# EAGLE design Arduino with Ribbon 7 segment display (EAGLE 7.2.0)
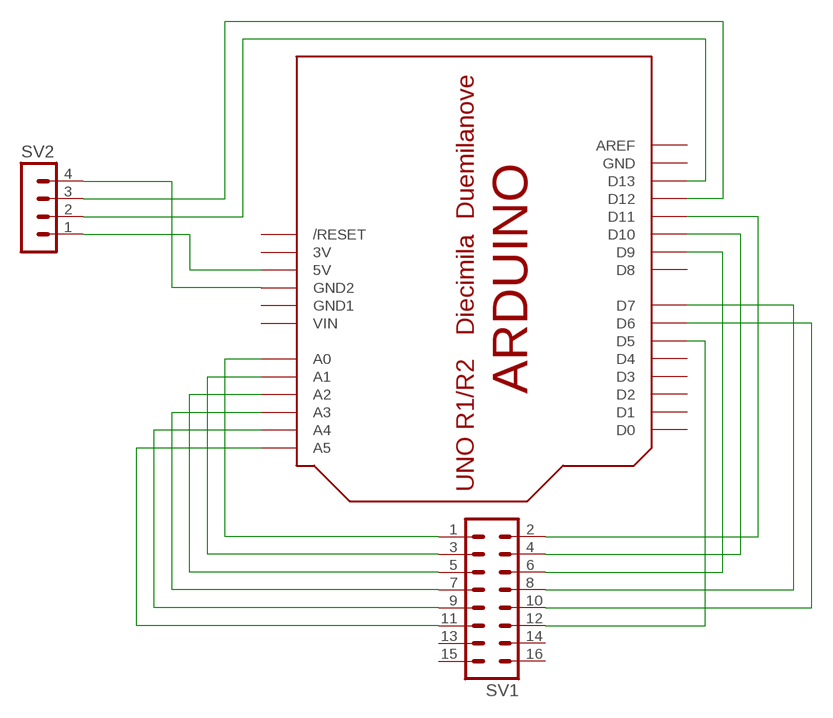
[diagram p0: schematic, sheet 1]

## Parts
SV1  MA08-2  [MA08-2]
SV2  MA04-1  [MA04-1]
U$1  ARDUINO-BPLACE  [ARDUINO-BPLACE]

## Nets
N$1: SV1.2 U$1.D11
N$2: SV1.4 U$1.D10
N$3: SV1.6 U$1.D9
N$4: SV1.8 U$1.D7
N$5: SV1.10 U$1.D6
N$6: SV1.12 U$1.D5
N$7: SV1.1 U$1.A0
N$8: SV1.3 U$1.A1
N$9: SV1.5 U$1.A2
N$10: SV1.7 U$1.A3
N$11: SV1.9 U$1.A4
N$12: SV1.11 U$1.A5
N$13: SV2.4 U$1.GND2
N$14: SV2.1 U$1.5V
N$15: SV2.3 U$1.D12
N$16: SV2.2 U$1.D13
Unconnected: SV1.13 SV1.14 SV1.15 SV1.16 U$1.AREF U$1.D0 U$1.D1 U$1.D2 U$1.D3 U$1.D4 U$1.D8 U$1.RESET(/RESET)

## Power pins joined to a net without a drawn wire
3V: U$1.3V
GND: U$1.GND
GND1: U$1.GND1
VIN: U$1.VIN

## Library data of the parts
SV1 = con-lstb:MA08-2: PIN HEADER; OC_FARNELL: unknown; OC_NEWARK: unknown
SV2 = con-lstb:MA04-1: PIN HEADER; OC_FARNELL: unknown; OC_NEWARK: unknown
U$1 = adafruit:ARDUINO: Arduino Diecimila/Duemilanove Make a shield with ease, this package has all the named pins as well as the two mounting drill holes and an outline of the USB and DC power connector. The outline is on the DIMENSION layer, so if your board house uses it they will cut the outline to match. http://www.ladyada.net/library/pcb/eaglelibrary.html

## Board
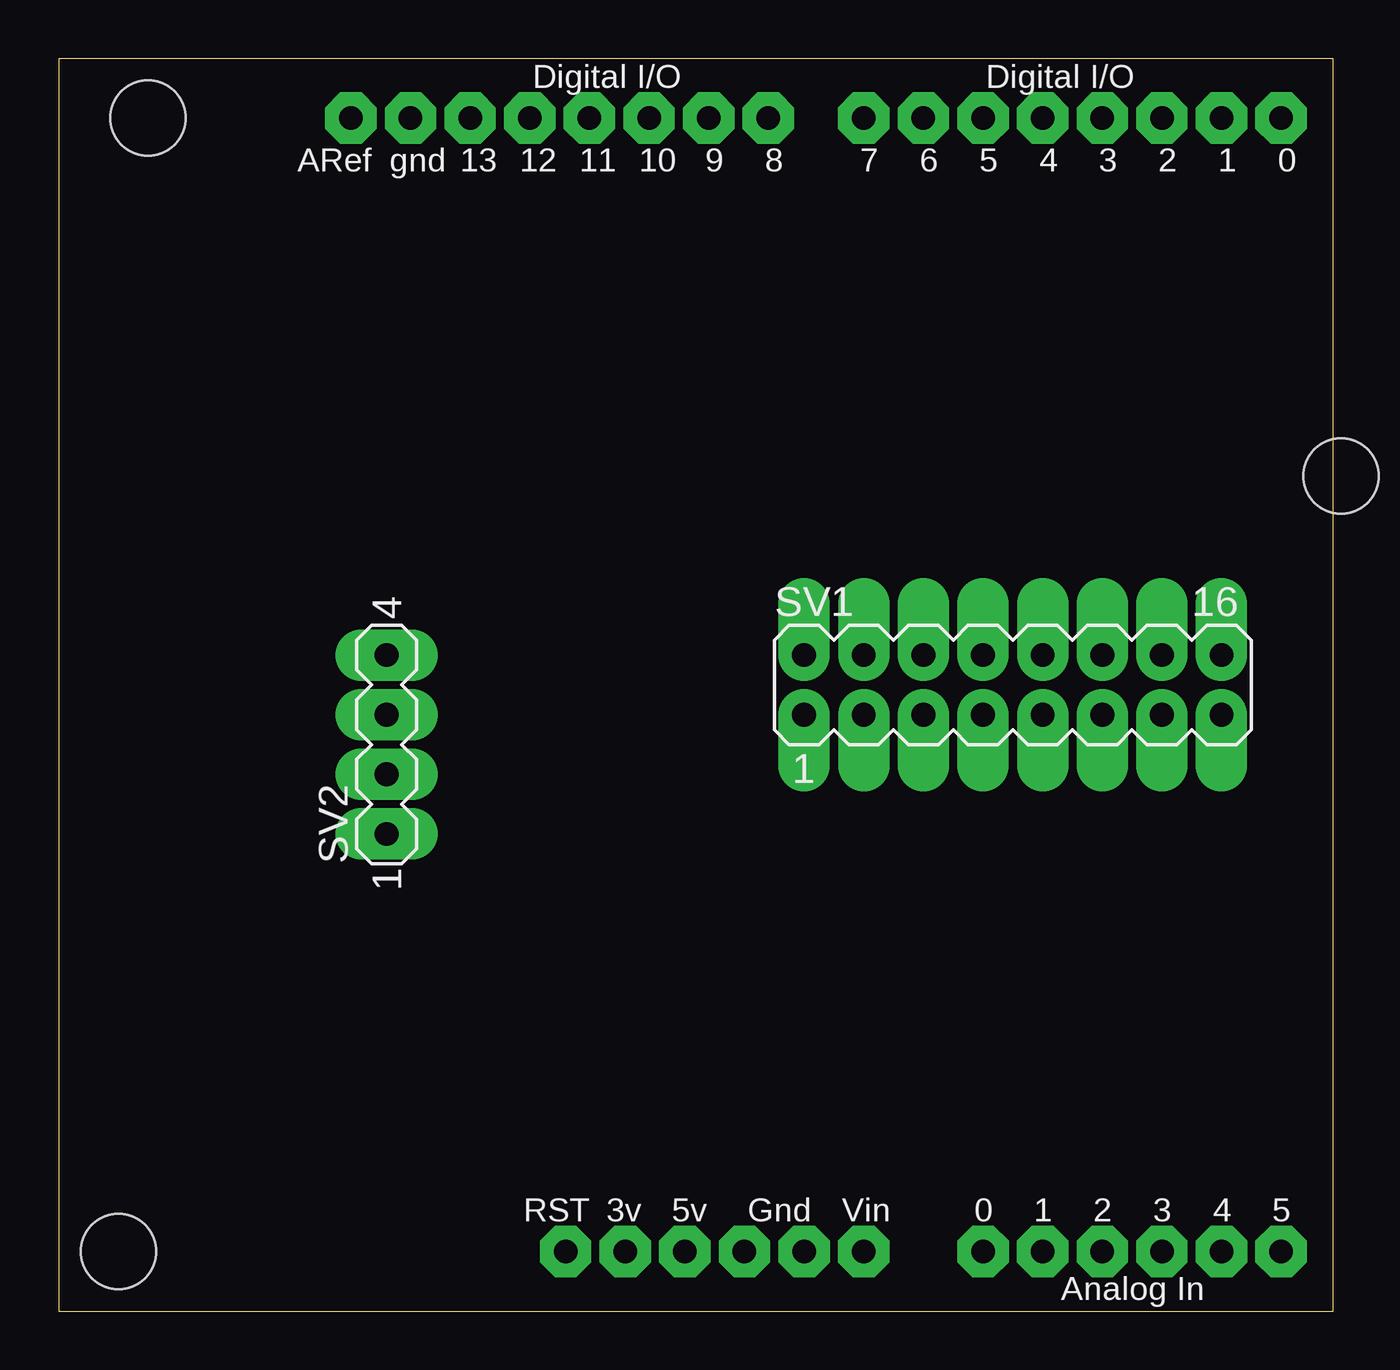
[diagram p1: board, top side]
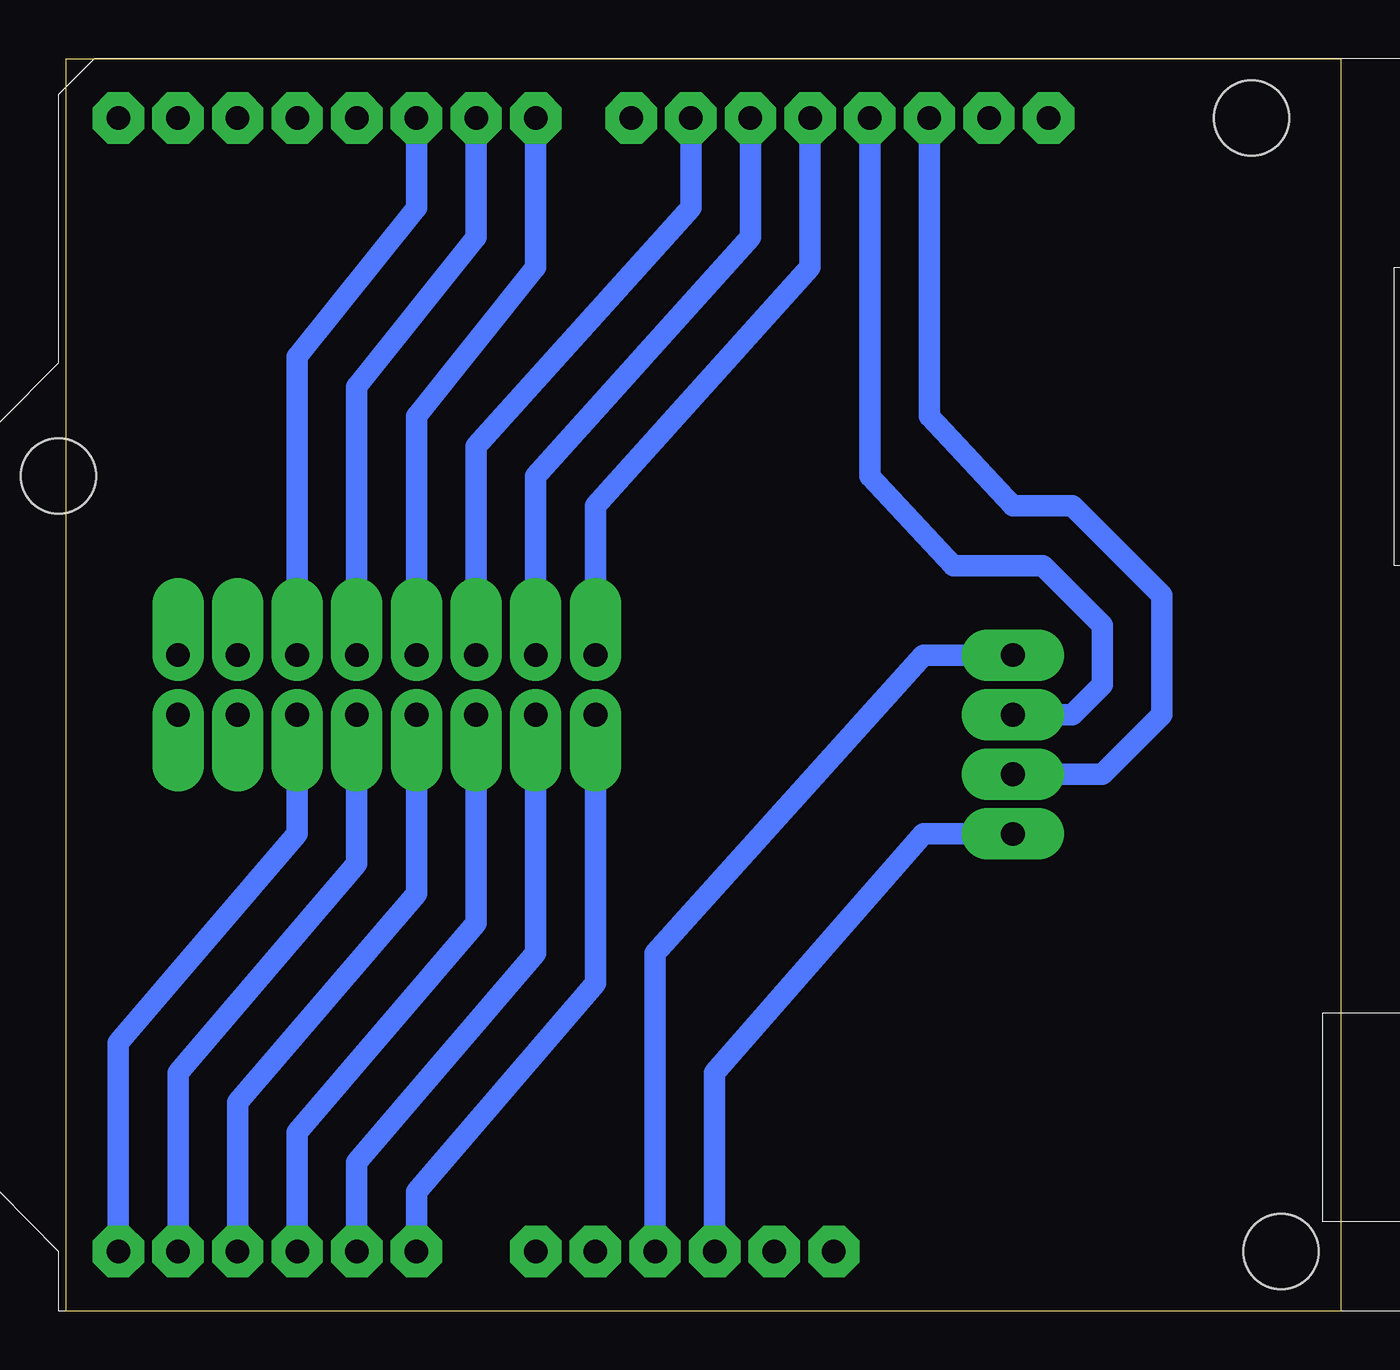
[diagram p2: board, bottom side, seen from below]

Size 54.28 x 53.33 mm. Coordinates in mm from the lower left corner, seen from the top.
Outline: 0,0 54.28,0 54.28,53.33 0,53.33 0,0
Copper layers (1*16): Top 0.035mm / dielectric 1.5mm / Bottom 0.035mm
Design rules "default": minimum track width 40mil, minimum drill 24mil, track to track 40mil, track to pad 40mil, pad to pad 40mil, via to via 40mil, smd to smd 8mil, copper to edge 40mil, drill to drill 8mil, minimum pad ring 10mil, minimum via ring 8mil, stop-mask expansion 4mil, vias tented up to drill 0mil, thermal gap 10mil

### Footprints (pad centres in the part's own frame; a part is rotated, then mirrored left to right if it is on the bottom)
MA08-2 = drill 1.016 pad 2.184 offset: 1 -8.89,-1.27; 2 -8.89,1.27; 3 -6.35,-1.27; 4 -6.35,1.27; 5 -3.81,-1.27; 6 -3.81,1.27; 7 -1.27,-1.27; 8 -1.27,1.27; 9 1.27,-1.27; 10 1.27,1.27; 11 3.81,-1.27; 12 3.81,1.27; 13 6.35,-1.27; 14 6.35,1.27; 15 8.89,-1.27; 16 8.89,1.27
MA04-1 = drill 1.016 pad 2.184 long: 1 -3.81,0; 2 -1.27,0; 3 1.27,0; 4 3.81,0
ARDUINO-BPLACE = drill 1 pad 2.184 octagon: 3V 35.56,2.54; 5V 38.1,2.54; A0 50.8,2.54; A1 53.34,2.54; A2 55.88,2.54; A3 58.42,2.54; A4 60.96,2.54; A5 63.5,2.54; AREF 23.876,50.8; D0 63.5,50.8; D1 60.96,50.8; D2 58.42,50.8; D3 55.88,50.8; D4 53.34,50.8; D5 50.8,50.8; D6 48.26,50.8; D7 45.72,50.8; D8 41.656,50.8; D9 39.116,50.8; D10 36.576,50.8; D11 34.036,50.8; D12 31.496,50.8; D13 28.956,50.8; GND 26.416,50.8; GND1 43.18,2.54; GND2 40.64,2.54; RESET 33.02,2.54; VIN 45.72,2.54 | hole 3.2: 15.24,50.8; 66.04,35.56; 13.97,2.54

### Placement (x,y rotation side)
SV1  40.64,26.67 0 top
SV2  13.97,24.13 90 top
U$1  -11.43,0 0 top

### Tracks (layer width: path | path; a pad name or v marks a point on that pad's centre or on a via)
N$1
  Bottom 0.914: SV1.2 31.75,34.29 22.61,44.45 U$1.D11
N$2
  Bottom 0.914: SV1.4 34.29,35.56 25.15,45.72 U$1.D10
N$3
  Bottom 0.914: SV1.6 36.83,36.83 27.69,46.99 U$1.D9
N$4
  Bottom 0.914: SV1.8 39.37,38.1 34.29,44.45 U$1.D7
N$5
  Bottom 0.914: SV1.10 41.91,39.37 36.83,45.72 U$1.D6
N$6
  Bottom 0.914: SV1.12 44.45,40.64 39.37,46.99 U$1.D5
N$7
  Bottom 0.914: U$1.A0 39.37,5.08 31.75,13.97 SV1.1
N$8
  Bottom 0.914: U$1.A1 41.91,6.35 34.29,15.24 SV1.3
N$9
  Bottom 0.914: U$1.A2 44.45,7.62 36.83,16.51 SV1.5
N$10
  Bottom 0.914: U$1.A3 46.99,8.89 39.37,17.78 SV1.7
N$11
  Bottom 0.914: U$1.A4 49.53,10.16 41.91,19.05 SV1.9
N$12
  Bottom 0.914: U$1.A5 52.07,11.43 44.45,20.32 SV1.11
N$13
  Bottom 0.914: U$1.GND2 29.21,15.24 17.78,27.94 SV2.4
N$14
  Bottom 0.914: SV2.1 17.78,20.32 26.67,10.16 U$1.5V
N$15
  Bottom 0.914: SV2.3 11.43,25.4 10.16,26.67 10.16,29.21 12.7,31.75 16.51,31.75 20.07,35.56 U$1.D12
N$16
  Bottom 0.914: SV2.2 10.16,22.86 7.62,25.4 7.62,30.48 11.43,34.29 13.97,34.29 17.53,38.1 U$1.D13